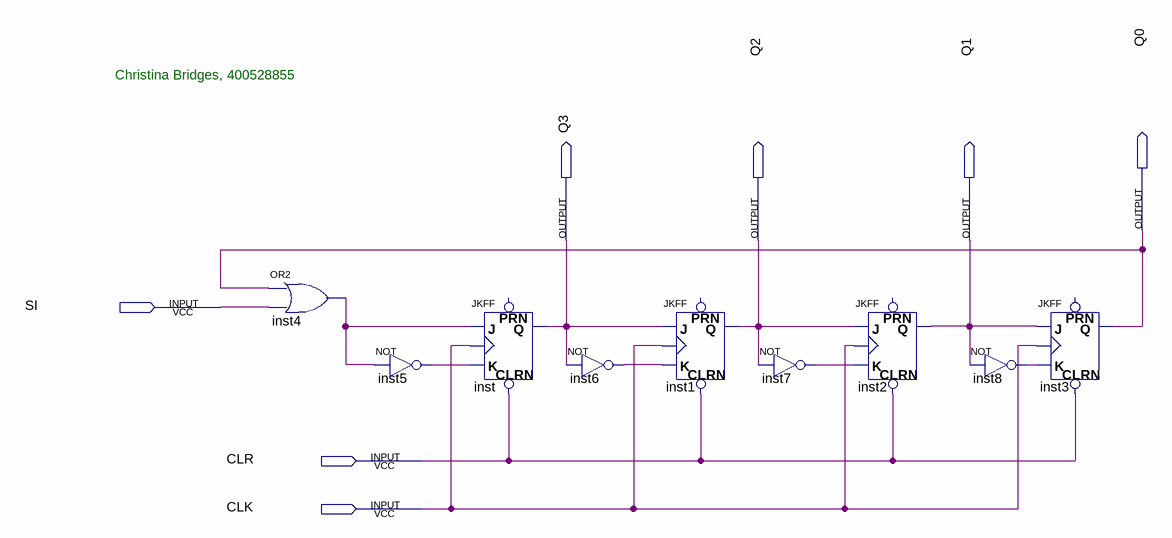
[diagram p0: schematic sheet]
// Quartus schematic lab4_1.bdf as structural Verilog: 9 symbols, 7 pins
module lab4_1 (
  input  SI,
  input  CLR,
  input  CLK,
  output Q0,
  output Q3,
  output Q2,
  output Q1
);

  wire inst4_out, inst5_out, inst6_out, inst7_out, inst8_out;

  or inst4 (inst4_out, Q0, SI);
  not inst5 (inst5_out, inst4_out);
  JKFF inst (.CLRN(CLR), .K(inst5_out), .J(inst4_out), .CLK(CLK), .Q(Q3));  // open: PRN
  not inst6 (inst6_out, Q3);
  JKFF inst1 (.CLRN(CLR), .K(inst6_out), .J(Q3), .CLK(CLK), .Q(Q2));  // open: PRN
  not inst7 (inst7_out, Q2);
  JKFF inst2 (.CLRN(CLR), .K(inst7_out), .J(Q2), .CLK(CLK), .Q(Q1));  // open: PRN
  not inst8 (inst8_out, Q1);
  JKFF inst3 (.CLRN(CLR), .K(inst8_out), .J(Q1), .CLK(CLK), .Q(Q0));  // open: PRN

  // Notes on the sheet:
  //   Christina Bridges, 400528855
endmodule
